# EAGLE design Display_PCB_Rev_1 (EAGLE 7.3.0)
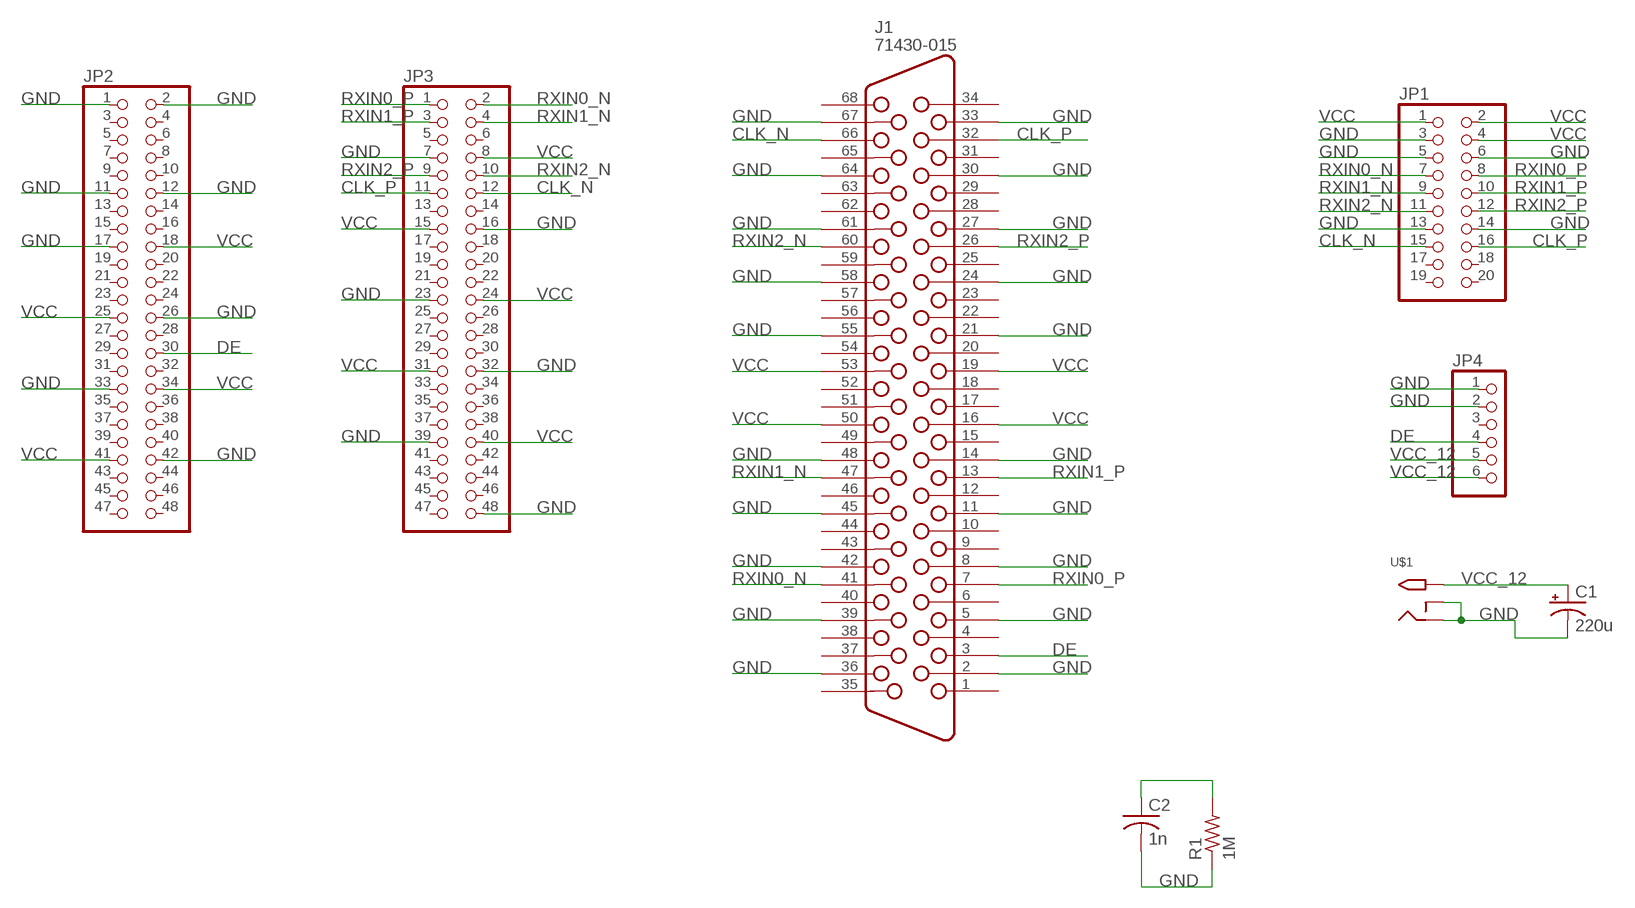
[diagram p0: schematic, sheet 1]

## Parts
C1  220u  CPOL-USE5-8.5  [E5-8,5]
C2  1n  C-USC0805  [C0805]
J1  71430-015  [71430-015]
JP1  PINHD-2X10M  [2X10M]
JP2  PINHD-2X24  [2X24]
JP3  PINHD-2X24  [2X24]
JP4  PINHD-1X6M  [1X06M]
R1  1M  R-US_R0805W  [R0805W]
U$1  2.1MMJACKTHM  [PJ-102A]

## Nets
CLK_N: J1.66 JP1.15 JP3.12
CLK_P: J1.32 JP1.16 JP3.11
DE: J1.3 JP2.30 JP4.4
GND: C1.- C2.2 J1.2 J1.5 J1.8 J1.11 J1.14 J1.21 J1.24 J1.27 J1.30 J1.33 J1.36 J1.39 J1.42 J1.45 J1.48 J1.55 J1.58 J1.61 J1.64 J1.67 JP1.3 JP1.5 JP1.6 JP1.13 JP1.14 JP2.1 JP2.2 JP2.11 JP2.12 JP2.17 JP2.26 JP2.33 JP2.42 JP3.7 JP3.16 JP3.23 JP3.32 JP3.39 JP3.48 JP4.1 JP4.2 R1.1 U$1.RING U$1.RING_SW
N$1: C2.1 R1.2
RXIN0_N: J1.41 JP1.7 JP3.2
RXIN0_P: J1.7 JP1.8 JP3.1
RXIN1_N: J1.47 JP1.9 JP3.4
RXIN1_P: J1.13 JP1.10 JP3.3
RXIN2_N: J1.60 JP1.11 JP3.10
RXIN2_P: J1.26 JP1.12 JP3.9
VCC: J1.16 J1.19 J1.50 J1.53 JP1.1 JP1.2 JP1.4 JP2.18 JP2.25 JP2.34 JP2.41 JP3.8 JP3.15 JP3.24 JP3.31 JP3.40
VCC_12: C1.+ JP4.5 JP4.6 U$1.TIP
Unconnected: J1.1 J1.4 J1.6 J1.9 J1.10 J1.12 J1.15 J1.17 J1.18 J1.20 J1.22 J1.23 J1.25 J1.28 J1.29 J1.31 J1.34 J1.35 J1.37 J1.38 J1.40 J1.43 J1.44 J1.46 J1.49 J1.51 J1.52 J1.54 J1.56 J1.57 J1.59 J1.62 J1.63 J1.65 J1.68 JP1.17 JP1.18 JP1.19 JP1.20 JP2.3 JP2.4 JP2.5 JP2.6 JP2.7 JP2.8 JP2.9 JP2.10 JP2.13 JP2.14 JP2.15 JP2.16 JP2.19 JP2.20 JP2.21 JP2.22 JP2.23 JP2.24 JP2.27 JP2.28 JP2.29 JP2.31 JP2.32 JP2.35 JP2.36 JP2.37 JP2.38 JP2.39 JP2.40 JP2.43 JP2.44 JP2.45 JP2.46 JP2.47 JP2.48 JP3.5 JP3.6 JP3.13 JP3.14 JP3.17 JP3.18 JP3.19 JP3.20 JP3.21 JP3.22 JP3.25 JP3.26 JP3.27 JP3.28 JP3.29 JP3.30 JP3.33 JP3.34 JP3.35 JP3.36 JP3.37 JP3.38 JP3.41 JP3.42 JP3.43 JP3.44 JP3.45 JP3.46 JP3.47 JP4.3

## Library data of the parts
C1 = resistor:CPOL-US: POLARIZED CAPACITOR, American symbol
C2 = resistor:C-US: CAPACITOR, American symbol
J1 = con-molex-vhdci:71430-015: VHDCI CONNECTOR
JP1 = pinhead:PINHD-2X10: PIN HEADER
JP2 JP3 = pinhead:PINHD-2X24: PIN HEADER
JP4 = pinhead:PINHD-1X6: PIN HEADER
R1 = resistor:R-US_: RESISTOR, American symbol
U$1 = adafruit:2.1MMJACK: 2.1mm x 5.5mm THM DC jack with internal switch. Digikey part #PJ-102A, 4UCON part #05537 2.1mm x 5.5mm SMT DC jack with internal switch. Digikey part #PJ-002A-SMT, 4UCON part #03267 By microbuilder.eu & adafruit.com

## Board
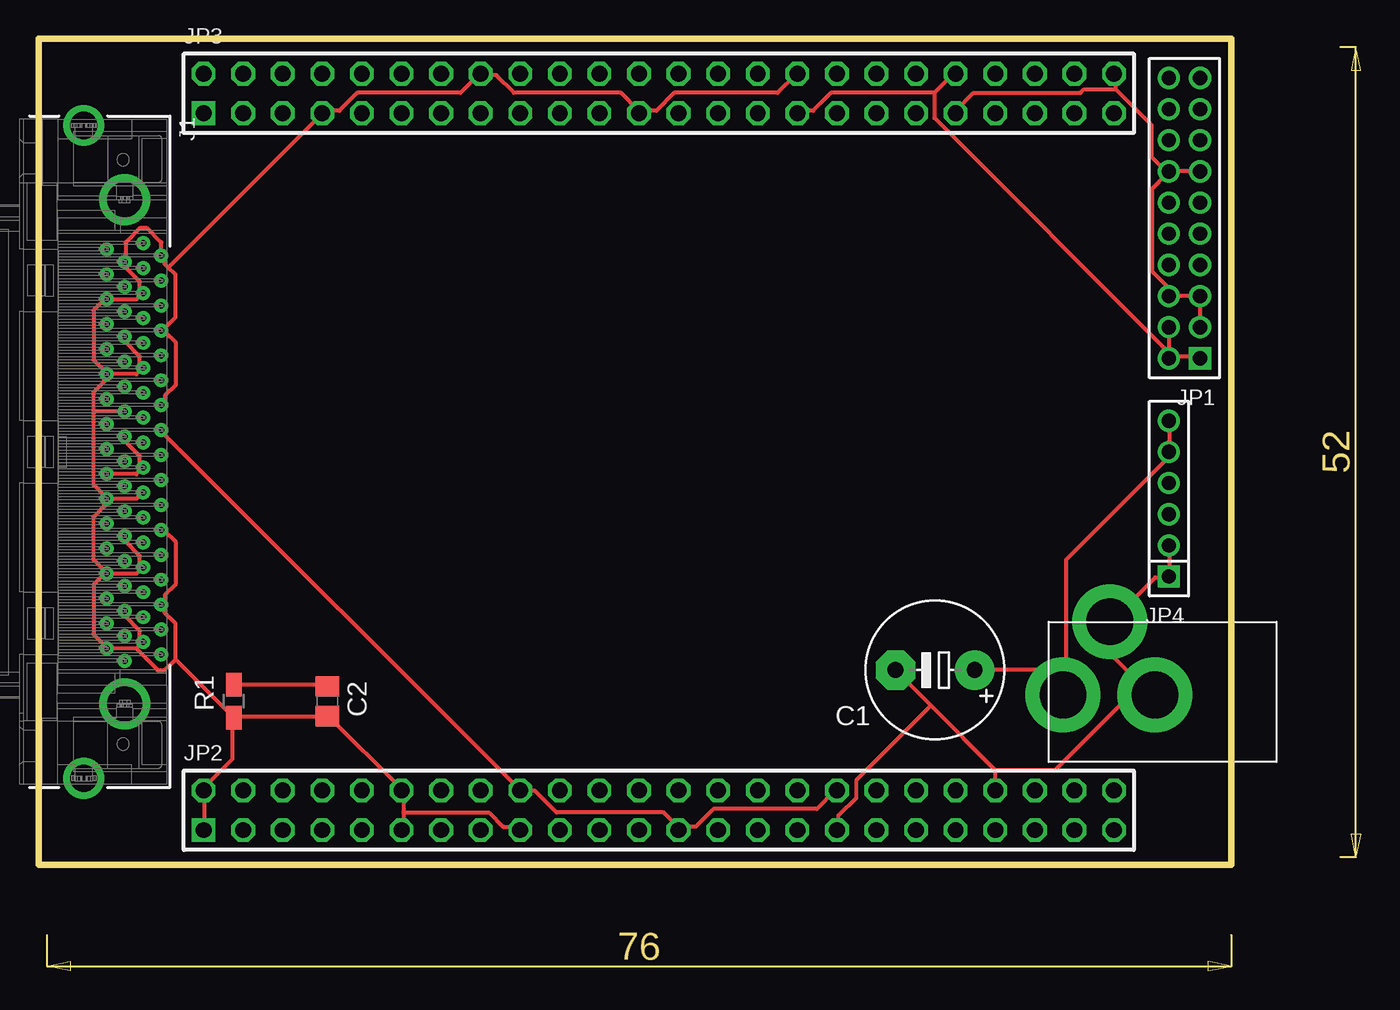
[diagram p1: board, top side]
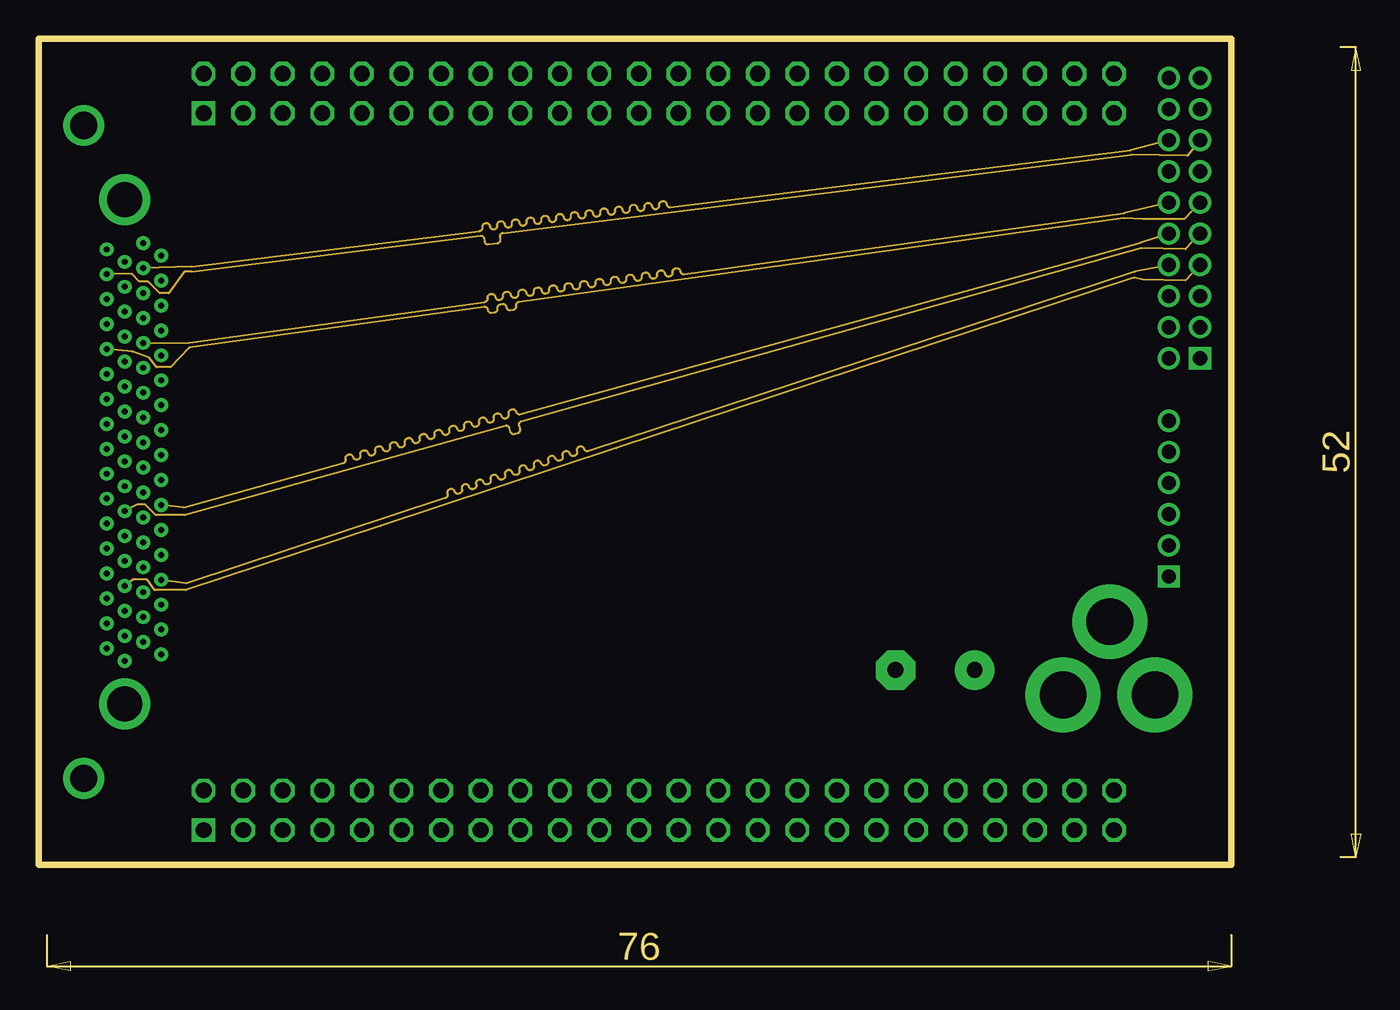
[diagram p2: board, inner layer Route2]
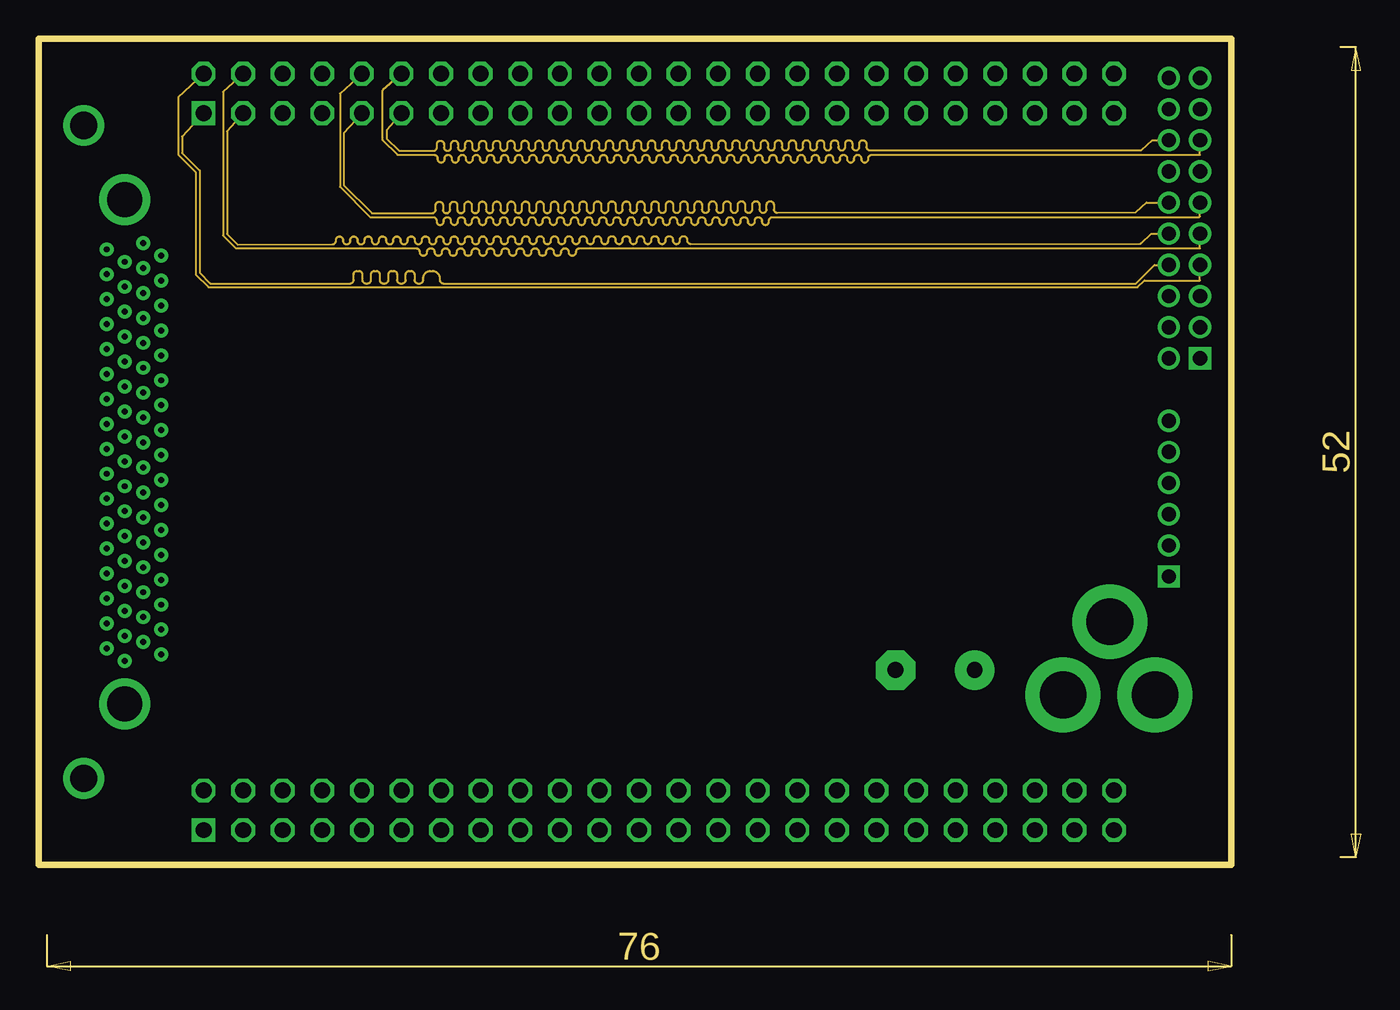
[diagram p3: board, inner layer Route3]
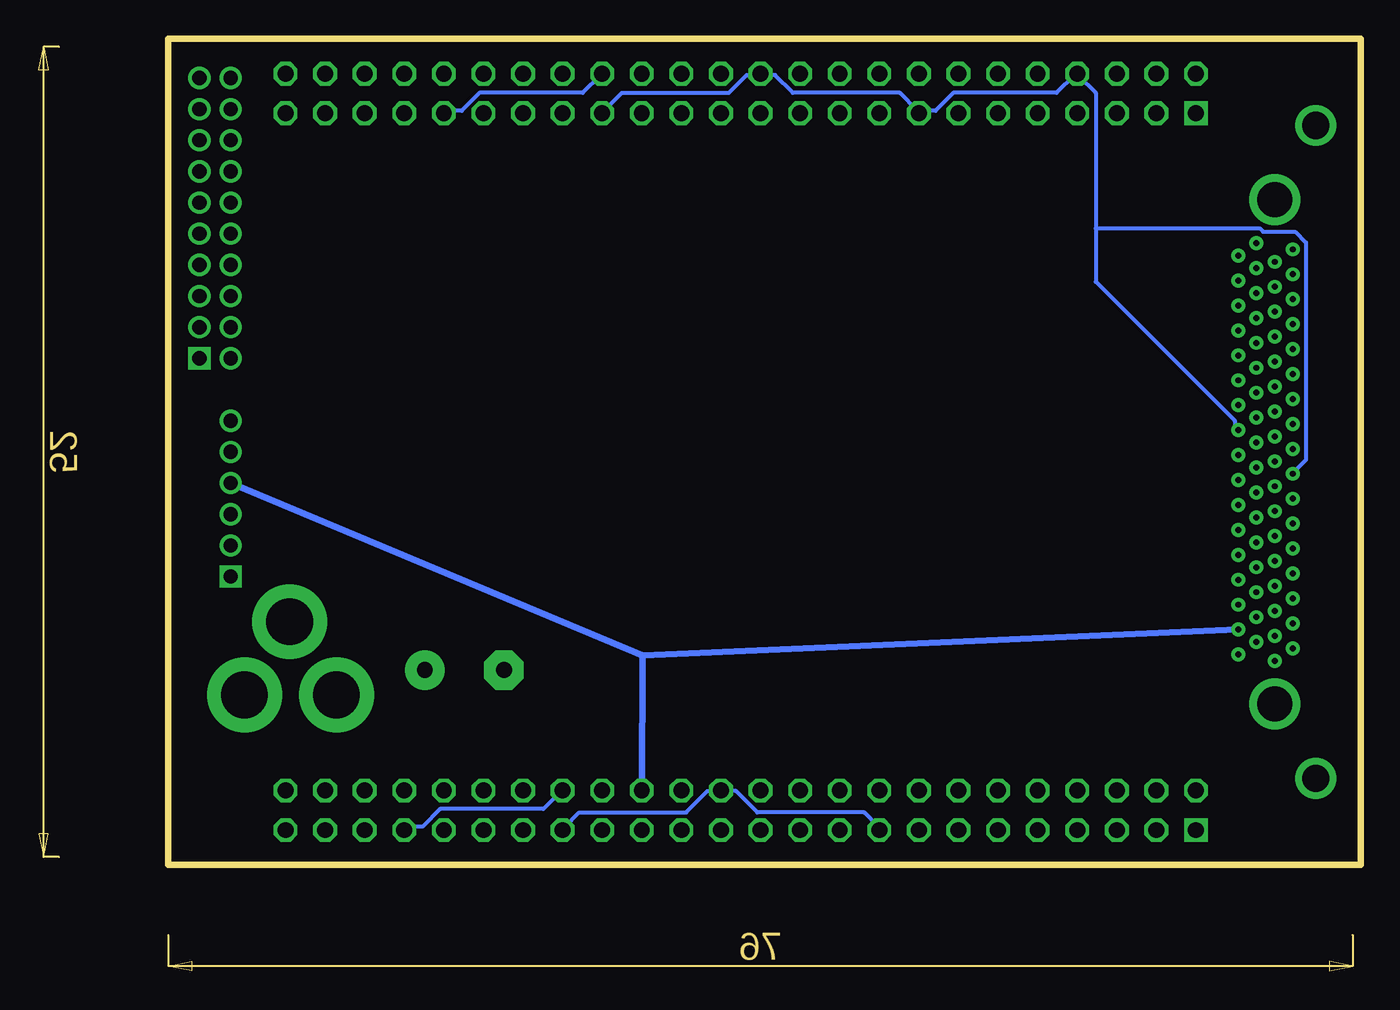
[diagram p4: board, bottom side, seen from below]

Size 76.5 x 53 mm. Coordinates in mm from the lower left corner, seen from the top.
Outline: 0,0 76.5,0 76.5,53 0,53 0,0
Copper layers (1*2+3*16): Top 0.035mm / dielectric 0.48mm / Route2 0.035mm / dielectric 0.49mm / Route3 0.035mm / dielectric 0.48mm / Bottom 0.035mm
Design rules "dirt_cheap_dirty_boards.v1 *": minimum track width 5mil, minimum drill 12mil, track to track 5mil, track to pad 5mil, pad to pad 5mil, via to via 5mil, smd to smd 0mil, copper to edge 10mil, drill to drill 10mil, minimum pad ring 10mil, minimum via ring 6mil, stop-mask expansion 2mil, vias tented up to drill 25mil, thermal gap 10mil

### Footprints (pad centres in the part's own frame; a part is rotated, then mirrored left to right if it is on the bottom)
E5-8,5 = drill 1.016 pad 2.54: + -2.54,0 | drill 1.016 pad 2.54 octagon: - 2.54,0
C0805 = smd 1.3 x 1.5: 1 -0.95,0; 2 0.95,0
71430-015 = drill 0.381: 1 13.005,2.35; 2 12.205,1.2; 3 11.405,2.35; 4 10.605,1.2; 5 9.805,2.35; 6 9.005,1.2; 7 8.205,2.35; 8 7.405,1.2; 9 6.605,2.35; 10 5.805,1.2; 11 5.005,2.35; 12 4.205,1.2; 13 3.405,2.35; 14 2.605,1.2; 15 1.805,2.35; 16 1.005,1.2; 17 0.205,2.35; 18 -0.595,1.2; 19 -1.395,2.35; 20 -2.195,1.2; 21 -2.995,2.35; 22 -3.795,1.2; 23 -4.595,2.35; 24 -5.395,1.2; 25 -6.195,2.35; 26 -6.995,1.2; 27 -7.795,2.35; 28 -8.595,1.2; 29 -9.395,2.35; 30 -10.195,1.2; 31 -10.995,2.35; 32 -11.795,1.2; 33 -12.595,2.35; 34 -13.395,1.2; 35 13.405,0; 36 12.605,-1.15; 37 11.805,0; 38 11.005,-1.15; 39 10.205,0; 40 9.405,-1.15; 41 8.605,0; 42 7.805,-1.15; 43 7.005,0; 44 6.205,-1.15; 45 5.405,0; 46 4.605,-1.15; 47 3.805,0; 48 3.005,-1.15; 49 2.205,0; 50 1.405,-1.15; 51 0.605,0; 52 -0.195,-1.15; 53 -0.995,0; 54 -1.795,-1.15; 55 -2.595,0; 56 -3.395,-1.15; 57 -4.195,0; 58 -4.995,-1.15; 59 -5.795,0; 60 -6.595,-1.15; 61 -7.395,0; 62 -8.195,-1.15; 63 -8.995,0; 64 -9.795,-1.15; 65 -10.595,0; 66 -11.395,-1.15; 67 -12.195,0; 68 -12.995,-1.15 | drill 2.25: M1 16.175,0; M2 -16.175,0 | drill 1.75: M3 -20.95,-2.63; M4 20.95,-2.63
2X10M = drill 0.914 square: 1 -9,-1 | drill 0.914: 2 -9,1; 3 -7,-1; 4 -7,1; 5 -5,-1; 6 -5,1; 7 -3,-1; 8 -3,1; 9 -1,-1; 10 -1,1; 11 1,-1; 12 1,1; 13 3,-1; 14 3,1; 15 5,-1; 16 5,1; 17 7,-1; 18 7,1; 19 9,-1; 20 9,1
2X24 = drill 1.016 square: 1 -27.94,-1.27 | drill 1.016 octagon: 2 -27.94,1.27; 3 -25.4,-1.27; 4 -25.4,1.27; 5 -22.86,-1.27; 6 -22.86,1.27; 7 -20.32,-1.27; 8 -20.32,1.27; 9 -17.78,-1.27; 10 -17.78,1.27; 11 -15.24,-1.27; 12 -15.24,1.27; 13 -12.7,-1.27; 14 -12.7,1.27; 15 -10.16,-1.27; 16 -10.16,1.27; 17 -7.62,-1.27; 18 -7.62,1.27; 19 -5.08,-1.27; 20 -5.08,1.27; 21 -2.54,-1.27; 22 -2.54,1.27; 23 0,-1.27; 24 0,1.27; 25 2.54,-1.27; 26 2.54,1.27; 27 5.08,-1.27; 28 5.08,1.27; 29 7.62,-1.27; 30 7.62,1.27; 31 10.16,-1.27; 32 10.16,1.27; 33 12.7,-1.27; 34 12.7,1.27; 35 15.24,-1.27; 36 15.24,1.27; 37 17.78,-1.27; 38 17.78,1.27; 39 20.32,-1.27; 40 20.32,1.27; 41 22.86,-1.27; 42 22.86,1.27; 43 25.4,-1.27; 44 25.4,1.27; 45 27.94,-1.27; 46 27.94,1.27; 47 30.48,-1.27; 48 30.48,1.27
1X06M = drill 0.914 square: 1 -5,0 | drill 0.914: 2 -3,0; 3 -1,0; 4 1,0; 5 3,0; 6 5,0
R0805W = smd 1.5 x 1: 1 -1.052,0; 2 1.052,0
PJ-102A = drill 3 pad 4.8: RING 0.1,-3.39; RING_SW -4.6,-6.29; TIP 0.1,-9.29

### Placement (x,y rotation side)
C1  57.5,12.5 180 top
C2  18.5,10.5 270 top
J1  5.5,26.5 270 top
JP1  73.5,41.5 90 top
JP2  38.5,3.5 0 top
JP3  38.5,49.5 0 top
JP4  72.5,23.5 90 top
R1  12.5,10.5 90 top
U$1  75,11 270 top

### Tracks (layer width: path | path; a pad name or v marks a point on that pad's centre or on a via)
CLK_N
  Route2 0.127: J1.66 5.94,37.94 6.44,37.44 7,37.44 7.75,36.69 8.31,36.69 9.31,38.06 9.8,38.07 28.32,40.37 arc-90 28.57,40.18 28.59,40.01 arc90 28.84,39.82 29.42,39.89 arc90 29.61,40.14 29.59,40.31 arc-90 29.78,40.55 70.08,45.56 73.69,45.5 JP1.15
  Route3 0.127: JP3.12 22.06,49.7 22.06,46.51 23.01,45.56 25.35,45.56 arc-90 25.58,45.34 25.58,45.29 arc90 25.8,45.07 25.81,45.07 arc90 26.03,45.29 26.03,45.34 arc-90 26.25,45.56 26.26,45.56 arc-90 26.48,45.34 26.48,45.29 arc90 26.7,45.07 26.71,45.07 arc90 26.94,45.29 26.94,45.34 arc-90 27.16,45.56 27.17,45.56 arc-90 27.39,45.34 27.39,45.29 arc90 27.61,45.07 27.62,45.07 arc90 27.84,45.29 27.84,45.34 arc-90 28.06,45.56 28.07,45.56 arc-90 28.3,45.34 28.3,45.29 arc90 28.52,45.07 28.53,45.07 arc90 28.75,45.29 28.75,45.34 arc-90 28.97,45.56 28.98,45.56 arc-90 29.2,45.34 29.2,45.29 arc90 29.42,45.07 29.43,45.07 arc90 29.65,45.29 29.65,45.34 arc-90 29.88,45.56 29.88,45.56 arc-90 30.11,45.34 30.11,45.29 arc90 30.33,45.07 30.34,45.07 arc90 30.56,45.29 30.56,45.34 arc-90 30.78,45.56 30.79,45.56 arc-90 31.01,45.34 31.01,45.29 arc90 31.24,45.07 31.24,45.07 arc90 31.47,45.29 31.47,45.34 arc-90 31.69,45.56 31.7,45.56 arc-90 31.92,45.34 31.92,45.29 arc90 32.14,45.07 32.15,45.07 arc90 32.37,45.29 32.37,45.34 arc-90 32.59,45.56 32.6,45.56 arc-90 32.83,45.34 32.83,45.29 arc90 33.05,45.07 33.06,45.07 arc90 33.28,45.29 33.28,45.34 arc-90 33.5,45.56 33.51,45.56 arc-90 33.73,45.34 33.73,45.29 arc90 33.95,45.07 33.96,45.07 arc90 34.19,45.29 34.19,45.34 arc-90 34.41,45.56 34.42,45.56 arc-90 34.64,45.34 34.64,45.29 arc90 34.86,45.07 34.87,45.07 arc90 35.09,45.29 35.09,45.34 arc-90 35.31,45.56 35.32,45.56 arc-90 35.55,45.34 35.55,45.29 arc90 35.77,45.07 35.77,45.07 arc90 36,45.29 36,45.34 arc-90 36.22,45.56 36.23,45.56 arc-90 36.45,45.34 36.45,45.29 arc90 36.67,45.07 36.68,45.07 arc90 36.9,45.29 36.9,45.34 arc-90 37.13,45.56 37.13,45.56 arc-90 37.36,45.34 37.36,45.29 arc90 37.58,45.07 37.59,45.07 arc90 37.81,45.29 37.81,45.34 arc-90 38.03,45.56 38.04,45.56 arc-90 38.26,45.34 38.26,45.29 arc90 38.48,45.07 38.49,45.07 arc90 38.72,45.29 38.72,45.34 arc-90 38.94,45.56 38.95,45.56 arc-90 39.17,45.34 39.17,45.29 arc90 39.39,45.07 39.4,45.07 arc90 39.62,45.29 39.62,45.34 arc-90 39.84,45.56 39.85,45.56 arc-90 40.08,45.34 40.08,45.29 arc90 40.3,45.07 40.31,45.07 arc90 40.53,45.29 40.53,45.34 arc-90 40.75,45.56 40.76,45.56 arc-90 40.98,45.34 40.98,45.29 arc90 41.2,45.07 41.21,45.07 arc90 41.44,45.29 41.44,45.34 arc-90 41.66,45.56 41.67,45.56 arc-90 41.89,45.34 41.89,45.29 arc90 42.11,45.07 42.12,45.07 arc90 42.34,45.29 42.34,45.34 arc-90 42.56,45.56 42.57,45.56 arc-90 42.79,45.34 42.79,45.29 arc90 43.02,45.07 43.02,45.07 arc90 43.25,45.29 43.25,45.34 arc-90 43.47,45.56 43.48,45.56 arc-90 43.7,45.34 43.7,45.29 arc90 43.92,45.07 43.93,45.07 arc90 44.15,45.29 44.15,45.34 arc-90 44.38,45.56 44.38,45.56 arc-90 44.61,45.34 44.61,45.29 arc90 44.83,45.07 44.84,45.07 arc90 45.06,45.29 45.06,45.34 arc-90 45.28,45.56 45.29,45.56 arc-90 45.51,45.34 45.51,45.29 arc90 45.73,45.07 45.74,45.07 arc90 45.97,45.29 45.97,45.34 arc-90 46.19,45.56 46.2,45.56 arc-90 46.42,45.34 46.42,45.29 arc90 46.64,45.07 46.65,45.07 arc90 46.87,45.29 46.87,45.34 arc-90 47.09,45.56 47.1,45.56 arc-90 47.33,45.34 47.33,45.29 arc90 47.55,45.07 47.56,45.07 arc90 47.78,45.29 47.78,45.34 arc-90 48,45.56 48.01,45.56 arc-90 48.23,45.34 48.23,45.29 arc90 48.45,45.07 48.46,45.07 arc90 48.68,45.29 48.68,45.34 arc-90 48.91,45.56 48.91,45.56 arc-90 49.14,45.34 49.14,45.29 arc90 49.36,45.07 49.37,45.07 arc90 49.59,45.29 49.59,45.34 arc-90 49.81,45.56 49.82,45.56 arc-90 50.04,45.34 50.04,45.29 arc90 50.27,45.07 50.27,45.07 arc90 50.5,45.29 50.5,45.34 arc-90 50.72,45.56 50.73,45.56 arc-90 50.95,45.34 50.95,45.29 arc90 51.17,45.07 51.18,45.07 arc90 51.4,45.29 51.4,45.34 arc-90 51.62,45.56 51.63,45.56 arc-90 51.86,45.34 51.86,45.29 arc90 52.08,45.07 52.09,45.07 arc90 52.31,45.29 52.31,45.34 arc-90 52.53,45.56 52.54,45.56 arc-90 52.76,45.34 52.76,45.29 arc90 52.98,45.07 52.99,45.07 arc90 53.22,45.29 53.22,45.34 arc-90 53.44,45.56 70.75,45.56 74.5,45.56 JP1.15
CLK_P
  Route2 0.127: J1.32 9.81,38.38 28.27,40.67 arc90 28.46,40.92 28.46,40.93 arc-90 28.66,41.18 28.69,41.18 arc-90 28.93,40.99 28.94,40.98 arc90 29.18,40.79 29.22,40.79 arc90 29.41,41.04 29.41,41.05 arc-90 29.6,41.3 29.63,41.3 arc-90 29.88,41.11 29.88,41.1 arc90 30.13,40.91 30.16,40.91 arc90 30.35,41.16 30.35,41.17 arc-90 30.55,41.41 30.58,41.42 arc-90 30.82,41.22 30.83,41.22 arc90 31.07,41.02 31.1,41.03 arc90 31.3,41.28 31.3,41.28 arc-90 31.49,41.53 31.52,41.54 arc-90 31.77,41.34 31.77,41.33 arc90 32.02,41.14 32.05,41.14 arc90 32.24,41.39 32.24,41.4 arc-90 32.43,41.65 32.47,41.65 arc-90 32.71,41.46 32.72,41.45 arc90 32.96,41.26 32.99,41.26 arc90 33.19,41.51 33.19,41.52 arc-90 33.38,41.77 33.41,41.77 arc-90 33.66,41.58 33.66,41.57 arc90 33.91,41.38 33.94,41.38 arc90 34.13,41.63 34.13,41.64 arc-90 34.32,41.89 34.35,41.89 arc-90 34.6,41.69 34.6,41.69 arc90 34.85,41.49 34.88,41.5 arc90 35.08,41.75 35.08,41.75 arc-90 35.27,42 35.3,42.01 arc-90 35.55,41.81 35.55,41.81 arc90 35.8,41.61 35.83,41.62 arc90 36.02,41.86 36.02,41.87 arc-90 36.21,42.12 36.24,42.12 arc-90 36.49,41.93 36.49,41.92 arc90 36.74,41.73 36.77,41.73 arc90 36.97,41.98 36.97,41.99 arc-90 37.16,42.24 37.19,42.24 arc-90 37.44,42.05 37.44,42.04 arc90 37.69,41.85 37.72,41.85 arc90 37.91,42.1 37.91,42.11 arc-90 38.1,42.36 38.13,42.36 arc-90 38.38,42.17 38.38,42.16 arc90 38.63,41.97 38.66,41.97 arc90 38.86,42.22 38.85,42.22 arc-90 39.05,42.47 39.08,42.48 arc-90 39.33,42.28 39.33,42.28 arc90 39.58,42.08 39.61,42.09 arc90 39.8,42.33 39.8,42.34 arc-90 39.99,42.59 40.02,42.59 arc-90 40.27,42.4 40.27,42.39 arc90 40.52,42.2 70.05,45.88 JP1.16
  Route3 0.127: JP3.11 22.31,47.16 22.31,46.61 23.12,45.81 25.31,45.82 arc90 25.54,46.04 25.54,46.24 arc-90 25.76,46.47 25.77,46.47 arc-90 25.99,46.24 25.99,46.04 arc90 26.21,45.82 26.22,45.82 arc90 26.44,46.04 26.44,46.25 arc-90 26.66,46.47 26.67,46.47 arc-90 26.89,46.25 26.89,46.04 arc90 27.11,45.82 27.12,45.82 arc90 27.34,46.04 27.34,46.25 arc-90 27.56,46.47 27.57,46.47 arc-90 27.8,46.25 27.8,46.04 arc90 28.02,45.82 28.02,45.82 arc90 28.25,46.04 28.25,46.25 arc-90 28.47,46.47 28.48,46.47 arc-90 28.7,46.25 28.7,46.04 arc90 28.92,45.82 28.93,45.82 arc90 29.15,46.05 29.15,46.25 arc-90 29.37,46.47 29.38,46.47 arc-90 29.6,46.25 29.6,46.05 arc90 29.82,45.82 29.83,45.82 arc90 30.05,46.05 30.05,46.25 arc-90 30.27,46.47 30.28,46.47 arc-90 30.51,46.25 30.51,46.05 arc90 30.73,45.82 30.73,45.82 arc90 30.96,46.05 30.96,46.25 arc-90 31.18,46.47 31.19,46.47 arc-90 31.41,46.25 31.41,46.05 arc90 31.63,45.83 31.64,45.83 arc90 31.86,46.05 31.86,46.25 arc-90 32.08,46.47 32.09,46.47 arc-90 32.31,46.25 32.31,46.05 arc90 32.53,45.83 32.54,45.83 arc90 32.76,46.05 32.76,46.25 arc-90 32.99,46.48 32.99,46.48 arc-90 33.22,46.25 33.22,46.05 arc90 33.44,45.83 33.45,45.83 arc90 33.67,46.05 33.67,46.25 arc-90 33.89,46.48 33.9,46.48 arc-90 34.12,46.25 34.12,46.05 arc90 34.34,45.83 34.35,45.83 arc90 34.57,46.05 34.57,46.26 arc-90 34.79,46.48 34.8,46.48 arc-90 35.02,46.26 35.02,46.05 arc90 35.24,45.83 35.25,45.83 arc90 35.47,46.05 35.47,46.26 arc-90 35.7,46.48 35.7,46.48 arc-90 35.93,46.26 35.93,46.05 arc90 36.15,45.83 36.16,45.83 arc90 36.38,46.05 36.38,46.26 arc-90 36.6,46.48 36.61,46.48 arc-90 36.83,46.26 36.83,46.06 arc90 37.05,45.83 37.06,45.83 arc90 37.28,46.06 37.28,46.26 arc-90 37.5,46.48 37.51,46.48 arc-90 37.73,46.26 37.73,46.06 arc90 37.95,45.83 37.96,45.83 arc90 38.18,46.06 38.18,46.26 arc-90 38.41,46.48 38.41,46.48 arc-90 38.64,46.26 38.64,46.06 arc90 38.86,45.83 38.87,45.83 arc90 39.09,46.06 39.09,46.26 arc-90 39.31,46.48 39.32,46.48 arc-90 39.54,46.26 39.54,46.06 arc90 39.76,45.84 39.77,45.84 arc90 39.99,46.06 39.99,46.26 arc-90 40.21,46.48 40.22,46.48 arc-90 40.44,46.26 40.44,46.06 arc90 40.67,45.84 40.67,45.84 arc90 40.9,46.06 40.89,46.26 arc-90 41.12,46.49 41.12,46.49 arc-90 41.35,46.27 41.35,46.06 arc90 41.57,45.84 41.58,45.84 arc90 41.8,46.06 41.8,46.27 arc-90 42.02,46.49 42.03,46.49 arc-90 42.25,46.27 42.25,46.06 arc90 42.47,45.84 42.48,45.84 arc90 42.7,46.06 42.7,46.27 arc-90 42.92,46.49 42.93,46.49 arc-90 43.15,46.27 43.15,46.06 arc90 43.38,45.84 43.38,45.84 arc90 43.6,46.06 43.6,46.27 arc-90 43.83,46.49 43.83,46.49 arc-90 44.06,46.27 44.06,46.06 arc90 44.28,45.84 44.29,45.84 arc90 44.51,46.06 44.51,46.27 arc-90 44.73,46.49 44.74,46.49 arc-90 44.96,46.27 44.96,46.06 arc90 45.18,45.84 45.19,45.84 arc90 45.41,46.07 45.41,46.27 arc-90 45.63,46.49 45.64,46.49 arc-90 45.86,46.27 45.86,46.07 arc90 46.09,45.84 46.09,45.84 arc90 46.31,46.07 46.31,46.27 arc-90 46.54,46.49 46.54,46.49 arc-90 46.77,46.27 46.77,46.07 arc90 46.99,45.85 47,45.85 arc90 47.22,46.07 47.22,46.27 arc-90 47.44,46.5 47.45,46.5 arc-90 47.67,46.27 47.67,46.07 arc90 47.89,45.85 47.9,45.85 arc90 48.12,46.07 48.12,46.27 arc-90 48.34,46.5 48.35,46.5 arc-90 48.57,46.27 48.57,46.07 arc90 48.8,45.85 48.8,45.85 arc90 49.02,46.07 49.02,46.28 arc-90 49.25,46.5 49.25,46.5 arc-90 49.48,46.28 49.48,46.07 arc90 49.7,45.85 49.71,45.85 arc90 49.93,46.07 49.93,46.28 arc-90 50.15,46.5 50.16,46.5 arc-90 50.38,46.28 50.38,46.07 arc90 50.6,45.85 50.61,45.85 arc90 50.83,46.07 50.83,46.28 arc-90 51.05,46.5 51.06,46.5 arc-90 51.28,46.28 51.28,46.07 arc90 51.51,45.85 51.51,45.85 arc90 51.74,46.07 51.73,46.28 arc-90 51.96,46.5 51.97,46.5 arc-90 52.19,46.28 52.19,46.08 arc90 52.41,45.85 52.42,45.85 arc90 52.64,46.08 52.64,46.28 arc-90 52.86,46.5 52.87,46.5 arc-90 53.09,46.28 53.09,46.08 arc90 53.31,45.85 70.75,45.88 71.44,46.5 JP1.16
DE
  Bottom 0.406: JP4.4 46.06,13.44 | 46.06,13.44 JP2.30 | J1.3 46.06,13.44
GND
  Top 0.254: JP1.14 72.54,44.51 74.37,44.51 JP1.13 | 69.11,49.77 69.11,50.68 JP3.48 | 69.11,49.77 71.4,47.48 71.4,45.42 72.31,44.51 JP1.14 | JP1.14 72.31,44.28 71.4,43.37 71.4,38.11 72.31,37.19 72.31,36.51 JP1.6 72.54,36.51 74.37,36.51 JP1.5 JP1.3 | JP3.32 48.54,50.68 47.39,49.54 40.76,49.54 39.62,48.39 38.71,48.39 JP3.23 38.48,48.39 37.34,49.54 30.48,49.54 29.33,50.68 28.42,50.68 JP3.16 28.19,50.68 27.05,49.54 20.42,49.54 19.27,48.39 18.36,48.39 JP3.7 18.13,48.17 8.3,38.34 | 69.11,49.77 67.05,49.77 66.82,49.54 59.97,49.54 58.82,48.39 JP3.39 | JP4.2 72.54,20.28 72.54,18.68 JP4.1 72.31,18.45 71.62,18.45 68.88,15.7 U$1.RING_SW 68.88,15.48 68.88,13.42 70.71,11.59 | 70.71,11.59 71.4,10.91 U$1.RING 70.71,11.59 | 61.34,6.1 61.34,4.96 JP2.42 | 57.22,10.22 55.17,12.28 C1.- | 57.22,10.22 61.34,6.1 | 57.22,10.22 52.42,5.42 52.42,4.27 51.28,3.13 51.28,2.45 JP2.33 | 70.71,11.59 65.22,6.1 61.34,6.1 | J1.58 4.42,31.48 6.25,31.48 6.47,31.71 J1.24 6.47,31.94 6.47,32.62 5.56,33.54 5.56,33.77 J1.61 | J1.58 4.19,31.71 3.5,32.39 3.5,35.59 4.19,36.28 J1.64 4.42,36.28 6.25,36.28 6.47,36.51 J1.30 6.47,36.74 6.47,37.42 5.56,38.34 5.56,38.56 J1.67 5.56,38.79 5.56,39.94 6.47,40.85 6.93,40.85 7.84,39.94 7.84,39.25 J1.33 8.07,39.02 8.07,38.56 8.3,38.34 | J1.21 8.07,29.65 8.07,30.11 8.76,30.79 8.76,33.54 8.07,34.22 J1.27 8.07,34.45 8.76,35.14 8.76,37.88 8.3,38.34 | J1.11 8.07,21.42 8.76,20.73 8.76,17.99 8.07,17.31 8.07,16.85 J1.5 8.07,16.62 8.07,16.16 8.76,15.48 8.76,13.19 | 6.25,13.88 4.42,13.88 J1.36 4.19,14.1 3.5,14.79 3.5,17.99 4.19,18.68 J1.42 | 6.25,13.88 6.47,14.1 J1.2 6.47,14.33 6.47,15.02 5.56,15.93 5.56,16.16 J1.39
  Top 0.254: J1.48 4.42,23.48 6.25,23.48 6.47,23.71 J1.14 | J1.42 4.42,18.68 6.25,18.68 6.47,18.91 J1.8 6.47,19.13 6.47,19.82 5.56,20.73 5.56,20.96 J1.45 | J1.48 4.19,23.48 4.19,23.02 3.5,22.34 3.5,19.59 4.19,18.91 J1.42 | 8.76,13.19 8.07,12.51 7.62,12.51 6.25,13.88 | 3.5,29 3.5,24.39 4.19,23.71 J1.48 | 3.5,29 3.5,30.34 4.19,31.02 4.19,31.48 J1.58 | 23.39,3.36 23.39,4.73 JP2.12 23.16,4.96 18.59,9.53 C2.2 18.36,9.53 12.65,9.53 R1.1 | 23.39,3.36 23.39,2.45 JP2.11 | 23.39,3.36 28.88,3.36 29.79,2.45 30.7,2.45 JP2.17 | R1.1 12.42,9.3 12.42,6.79 10.59,4.96 JP2.2 10.59,4.73 10.59,2.45 JP2.1 | 8.76,13.19 12.42,9.53 R1.1 | J1.55 3.6,29.09 3.5,29
  Bottom 0.254: JP3.39 58.59,48.39 57.68,48.39 56.54,49.54 49.91,49.54 48.77,50.68 JP3.32 | JP2.33 51.05,2.45 50.14,3.36 43.28,3.36 41.91,4.73 41.22,4.73 JP2.26 40.99,4.73 40.08,4.73 38.71,3.36 31.85,3.36 30.93,2.45 JP2.17
N$1
  Top 0.254: C2.1 18.36,11.59 12.65,11.59 R1.2
RXIN0_N
  Route2 0.127: JP1.7 73.56,37.5 70.81,37.56 70.26,37.68 37.04,26.73 21.9,21.74 9.41,17.63 7.44,17.62 6.94,18.31 6.06,18.31 J1.41
  Route3 0.127: JP3.2 8.94,49.27 8.94,45.57 10.06,44.45 10.06,37.89 10.89,37.06 70.49,37.06 70.93,37.5 74.5,37.5 JP1.7
RXIN0_P
  Route2 0.127: JP1.8 70.31,38.06 35.26,26.55 arc-90 34.98,26.69 34.98,26.7 arc90 34.7,26.84 34.66,26.83 arc90 34.52,26.55 34.52,26.54 arc-90 34.38,26.26 34.34,26.24 arc-90 34.06,26.39 34.06,26.39 arc90 33.78,26.54 33.74,26.52 arc90 33.59,26.24 33.6,26.23 arc-90 33.46,25.95 33.42,25.94 arc-90 33.14,26.08 33.13,26.09 arc90 32.85,26.23 32.81,26.22 arc90 32.67,25.94 32.67,25.93 arc-90 32.53,25.65 32.49,25.64 arc-90 32.21,25.78 32.21,25.79 arc90 31.93,25.93 31.89,25.92 arc90 31.75,25.64 31.75,25.63 arc-90 31.61,25.35 31.57,25.33 arc-90 31.29,25.48 31.29,25.48 arc90 31.01,25.63 30.97,25.61 arc90 30.83,25.33 30.83,25.32 arc-90 30.69,25.04 30.65,25.03 arc-90 30.37,25.17 30.36,25.18 arc90 30.08,25.32 30.05,25.31 arc90 29.9,25.03 29.91,25.02 arc-90 29.76,24.74 29.73,24.73 arc-90 29.44,24.87 29.44,24.88 arc90 29.16,25.02 29.12,25.01 arc90 28.98,24.73 28.98,24.72 arc-90 28.84,24.44 28.8,24.42 arc-90 28.52,24.57 28.52,24.57 arc90 28.24,24.72 28.2,24.7 arc90 28.06,24.42 28.06,24.41 arc-90 27.92,24.13 27.88,24.12 arc-90 27.6,24.26 27.59,24.27 arc90 27.31,24.41 27.27,24.4 arc90 27.13,24.12 27.14,24.11 arc-90 26.99,23.83 26.95,23.82 arc-90 26.67,23.96 26.67,23.97 arc90 26.39,24.11 26.35,24.1 arc90 26.21,23.82 26.21,23.81 arc-90 26.07,23.53 9.44,18.06 J1.7
  Route3 0.127: JP3.1 9.19,46.73 9.19,45.68 10.31,44.55 10.31,37.99 10.99,37.31 19.97,37.31 arc90 20.19,37.54 20.19,37.89 arc-90 20.41,38.11 20.53,38.11 arc-90 20.75,37.89 20.75,37.54 arc90 20.97,37.31 21.08,37.31 arc90 21.31,37.54 21.31,37.89 arc-90 21.53,38.11 21.64,38.11 arc-90 21.86,37.89 21.86,37.54 arc90 22.09,37.31 22.2,37.31 arc90 22.42,37.54 22.42,37.89 arc-90 22.64,38.11 22.76,38.11 arc-90 22.98,37.89 22.98,37.54 arc90 23.2,37.31 23.31,37.31 arc90 23.53,37.54 23.53,37.89 arc-90 23.76,38.11 23.87,38.11 arc-90 24.09,37.89 24.09,37.54 arc90 24.31,37.31 24.43,37.31 arc90 24.65,37.54 24.65,37.64 arc-90 25.13,38.11 25.24,38.11 arc-90 25.72,37.64 25.72,37.54 arc90 25.94,37.31 70.39,37.31 71.57,38.5 JP1.8
RXIN1_N
  Route2 0.127: JP1.9 73.56,39.5 70.75,39.56 30.95,28.46 arc90 30.8,28.18 30.86,27.95 arc-90 30.71,27.68 30.53,27.63 arc-90 30.26,27.79 30.19,28.02 arc90 29.92,28.17 9.38,22.44 7.5,22.44 6.81,23.12 6.31,23.12 J1.47
  Route3 0.127: JP3.4 11.81,49.61 11.81,40.39 12.64,39.56 24.2,39.56 arc-90 24.43,39.34 24.43,39.32 arc90 24.65,39.1 24.68,39.1 arc90 24.91,39.32 24.91,39.34 arc-90 25.13,39.56 25.16,39.56 arc-90 25.38,39.34 25.38,39.32 arc90 25.6,39.1 25.64,39.1 arc90 25.86,39.32 25.86,39.34 arc-90 26.08,39.56 26.12,39.56 arc-90 26.34,39.34 26.34,39.32 arc90 26.56,39.1 26.59,39.1 arc90 26.82,39.32 26.82,39.34 arc-90 27.04,39.56 27.07,39.56 arc-90 27.3,39.34 27.3,39.32 arc90 27.52,39.1 27.55,39.1 arc90 27.77,39.32 27.77,39.34 arc-90 27.99,39.56 28.03,39.56 arc-90 28.25,39.34 28.25,39.32 arc90 28.47,39.1 28.51,39.1 arc90 28.73,39.32 28.73,39.34 arc-90 28.95,39.56 28.98,39.56 arc-90 29.21,39.34 29.21,39.32 arc90 29.43,39.1 29.46,39.1 arc90 29.69,39.32 29.69,39.34 arc-90 29.91,39.56 29.94,39.56 arc-90 30.16,39.34 30.16,39.32 arc90 30.38,39.1 30.42,39.1 arc90 30.64,39.32 30.64,39.34 arc-90 30.86,39.56 30.9,39.56 arc-90 31.12,39.34 31.12,39.32 arc90 31.34,39.1 31.38,39.1 arc90 31.6,39.32 31.6,39.34 arc-90 31.82,39.56 31.85,39.56 arc-90 32.08,39.34 32.08,39.32 arc90 32.3,39.1 32.33,39.1 arc90 32.55,39.32 32.55,39.34 arc-90 32.77,39.56 32.81,39.56 arc-90 33.03,39.34 33.03,39.32 arc90 33.25,39.1 33.29,39.1 arc90 33.51,39.32 33.51,39.34 arc-90 33.73,39.56 33.77,39.56 arc-90 33.99,39.34 33.99,39.32 arc90 34.21,39.1 34.24,39.1 arc90 34.47,39.32 34.47,39.34 arc-90 34.69,39.56 70.69,39.56 74.5,39.56 JP1.9
RXIN1_P
  Route2 0.127: J1.13 9.28,22.94 19.52,25.77 arc90 19.68,26.05 | JP1.10 70.69,39.94 30.89,28.92 arc-90 30.62,29.07 30.62,29.08 arc90 30.35,29.23 30.3,29.22 arc90 30.14,28.94 | 19.68,26.05 | 19.68,26.05 arc-90 19.83,26.32 19.88,26.33 arc-90 20.15,26.18 20.15,26.18 arc90 20.43,26.02 20.47,26.03 arc90 20.63,26.31 20.63,26.31 arc-90 20.78,26.58 20.83,26.59 arc-90 21.1,26.44 | 21.1,26.44 | 21.1,26.44 arc90 21.38,26.28 21.43,26.3 arc90 21.58,26.57 | 21.58,26.57 | 21.58,26.57 arc-90 21.73,26.84 21.78,26.86 arc-90 22.06,26.7 22.06,26.7 arc90 22.33,26.55 22.38,26.56 arc90 22.53,26.84 | 22.53,26.84 | 22.53,26.84 arc-90 22.69,27.11 22.73,27.12 arc-90 23.01,26.97 | 23.01,26.97 | 23.01,26.97 arc90 23.28,26.81 23.33,26.83 arc90 23.48,27.1 23.48,27.1 arc-90 23.64,27.37 23.69,27.38 arc-90 23.96,27.23 23.96,27.23 arc90 24.23,27.08 24.28,27.09 arc90 24.44,27.36 | 24.44,27.36 | 24.44,27.36 arc-90 24.59,27.64 24.64,27.65 arc-90 24.91,27.49 | 24.91,27.49 | 24.91,27.49 arc90 25.18,27.34 25.23,27.35 arc90 25.39,27.62 25.39,27.63 arc-90 25.54,27.9 25.59,27.91 arc-90 25.86,27.76 25.86,27.76 arc90 26.14,27.6 26.18,27.62 arc90 26.34,27.89 | 26.34,27.89 | 26.34,27.89 arc-90 26.49,28.16 26.54,28.18 arc-90 26.81,28.02 | 26.81,28.02 | 26.81,28.02 arc90 27.09,27.87 27.13,27.88 arc90 27.29,28.15 27.29,28.15 arc-90 27.44,28.43 27.49,28.44 arc-90 27.77,28.28 | 27.77,28.28 | 27.77,28.28 arc90 28.04,28.13 28.09,28.14 arc90 28.24,28.42 | 28.24,28.42 | 28.24,28.42 arc-90 28.4,28.69 28.44,28.7 arc-90 28.72,28.55 28.72,28.55 arc90 28.99,28.39 29.04,28.41 arc90 29.19,28.68 29.19,28.68 arc-90 29.35,28.95 29.4,28.97 arc-90 29.67,28.81
  Route2 0.127: 29.67,28.81 | 29.67,28.81 arc90 29.94,28.66 29.99,28.67 arc90 30.14,28.94 | 30.14,28.94
  Route3 0.127: JP3.3 12.06,47.07 12.06,40.49 12.74,39.81 18.83,39.82 arc90 19.06,40.04 19.06,40.1 arc-90 19.28,40.32 19.29,40.32 arc-90 19.52,40.1 19.52,40.04 arc90 19.74,39.82 19.75,39.82 arc90 19.98,40.05 19.98,40.1 arc-90 20.2,40.32 20.21,40.32 arc-90 20.44,40.1 20.44,40.05 arc90 20.66,39.82 20.67,39.82 arc90 20.9,40.05 20.9,40.1 arc-90 21.12,40.32 21.13,40.32 arc-90 21.35,40.1 21.35,40.05 arc90 21.58,39.82 21.59,39.82 arc90 21.81,40.05 21.81,40.1 arc-90 22.04,40.32 22.05,40.32 arc-90 22.27,40.1 22.27,40.05 arc90 22.5,39.83 22.51,39.83 arc90 22.73,40.05 22.73,40.1 arc-90 22.96,40.33 22.97,40.33 arc-90 23.2,40.1 23.2,40.05 arc90 23.42,39.83 23.43,39.83 arc90 23.66,40.05 23.66,40.1 arc-90 23.88,40.33 23.89,40.33 arc-90 24.12,40.1 24.12,40.05 arc90 24.34,39.83 24.35,39.83 arc90 24.58,40.05 24.57,40.1 arc-90 24.8,40.33 24.81,40.33 arc-90 25.03,40.11 25.03,40.05 arc90 25.26,39.83 25.27,39.83 arc90 25.49,40.05 25.49,40.11 arc-90 25.72,40.33 25.73,40.33 arc-90 25.95,40.11 25.95,40.05 arc90 26.18,39.83 26.19,39.83 arc90 26.41,40.05 26.41,40.11 arc-90 26.64,40.33 26.65,40.33 arc-90 26.87,40.11 26.87,40.05 arc90 27.1,39.83 27.11,39.83 arc90 27.33,40.05 27.33,40.11 arc-90 27.56,40.33 27.57,40.33 arc-90 27.79,40.11 27.79,40.05 arc90 28.02,39.83 28.03,39.83 arc90 28.25,40.05 28.25,40.11 arc-90 28.48,40.33 28.49,40.33 arc-90 28.71,40.11 28.71,40.05 arc90 28.94,39.83 28.95,39.83 arc90 29.17,40.05 29.17,40.11 arc-90 29.4,40.33 29.41,40.33 arc-90 29.63,40.11 29.63,40.06 arc90 29.86,39.83 29.87,39.83 arc90 30.09,40.06 30.09,40.11 arc-90 30.31,40.33 30.33,40.33 arc-90 30.55,40.11 30.55,40.06 arc90 30.78,39.83 30.79,39.83 arc90 31.01,40.06 31.01,40.11 arc-90 31.23,40.33 31.25,40.33 arc-90 31.47,40.11 31.47,40.06 arc90 31.7,39.83 31.71,39.83 arc90 31.93,40.06 31.93,40.11 arc-90 32.16,40.33 32.17,40.33 arc-90 32.39,40.11 32.39,40.06 arc90 32.62,39.84 32.63,39.84 arc90 32.85,40.06 32.85,40.11 arc-90 33.08,40.34 33.09,40.34 arc-90 33.31,40.11 33.31,40.06 arc90 33.53,39.84 33.55,39.84 arc90 33.77,40.06 33.77,40.11 arc-90 33.99,40.34 34.01,40.34 arc-90 34.23,40.11 34.23,40.06 arc90 34.45,39.84 34.47,39.84 arc90 34.69,40.06 34.69,40.11 arc-90 34.91,40.34 34.93,40.34 arc-90 35.15,40.12 35.15,40.06 arc90 35.38,39.84 35.39,39.84 arc90 35.61,40.06 35.61,40.12 arc-90 35.83,40.34 35.85,40.34 arc-90 36.07,40.12 36.07,40.06 arc90 36.29,39.84 36.31,39.84 arc90 36.53,40.06 36.53,40.12 arc-90 36.75,40.34 36.77,40.34 arc-90 36.99,40.12 36.99,40.06 arc90 37.21,39.84 37.23,39.84 arc90 37.45,40.06 37.45,40.12 arc-90 37.67,40.34 37.69,40.34 arc-90 37.91,40.12 37.91,40.06 arc90 38.13,39.84 38.15,39.84 arc90 38.37,40.06 38.37,40.12 arc-90 38.59,40.34 38.61,40.34 arc-90 38.83,40.12 38.83,40.06 arc90 39.05,39.84 39.07,39.84 arc90 39.29,40.06 39.29,40.12 arc-90 39.51,40.34 39.53,40.34 arc-90 39.75,40.12 39.75,40.07 arc90 39.97,39.84 39.99,39.84 arc90 40.21,40.07 40.21,40.12 arc-90 40.43,40.34 40.45,40.34 arc-90 40.67,40.12 40.67,40.07 arc90 40.89,39.84 40.91,39.84 arc90 41.13,40.07 41.13,40.12 arc-90 41.35,40.34 41.37,40.34 arc-90 41.59,40.12 41.59,40.07 arc90 41.81,39.85 70.69,39.88 71.37,40.5 JP1.10
RXIN2_N
  Route2 0.127: JP1.11 73.5,41.44 70.81,41.44 69.62,41.5 30.8,36.12 arc90 30.61,35.87 30.61,35.85 arc-90 30.42,35.6 30.26,35.58 arc-90 30.01,35.77 30.01,35.78 arc90 29.76,35.97 29.6,35.95 arc90 29.41,35.7 29.41,35.69 arc-90 29.22,35.44 29.06,35.41 arc-90 28.81,35.6 28.81,35.62 arc90 28.55,35.81 9.64,33.19 8.44,31.94 7.56,31.94 7.06,32.56 6,32.94 J1.60
  Route3 0.127: JP3.10 19.31,49.49 19.31,43.51 21.26,41.56 25.3,41.56 arc-90 25.52,41.34 25.52,41.29 arc90 25.74,41.06 25.75,41.06 arc90 25.97,41.29 25.97,41.34 arc-90 26.19,41.56 26.2,41.56 arc-90 26.42,41.34 26.42,41.29 arc90 26.65,41.06 26.66,41.06 arc90 26.88,41.29 26.88,41.34 arc-90 27.1,41.56 27.11,41.56 arc-90 27.33,41.34 27.33,41.29 arc90 27.55,41.06 27.56,41.06 arc90 27.78,41.29 27.78,41.34 arc-90 28.01,41.56 28.02,41.56 arc-90 28.24,41.34 28.24,41.29 arc90 28.46,41.06 28.47,41.06 arc90 28.69,41.29 28.69,41.34 arc-90 28.91,41.56 28.92,41.56 arc-90 29.15,41.34 29.15,41.29 arc90 29.37,41.06 29.38,41.06 arc90 29.6,41.29 29.6,41.34 arc-90 29.82,41.56 29.83,41.56 arc-90 30.05,41.34 30.05,41.29 arc90 30.28,41.06 30.28,41.06 arc90 30.51,41.29 30.51,41.34 arc-90 30.73,41.56 30.74,41.56 arc-90 30.96,41.34 30.96,41.29 arc90 31.18,41.06 31.19,41.06 arc90 31.41,41.29 31.41,41.34 arc-90 31.64,41.56 31.65,41.56 arc-90 31.87,41.34 31.87,41.29 arc90 32.09,41.06 32.1,41.06 arc90 32.32,41.29 32.32,41.34 arc-90 32.55,41.56 32.55,41.56 arc-90 32.78,41.34 32.78,41.29 arc90 33,41.06 33.01,41.06 arc90 33.23,41.29 33.23,41.34 arc-90 33.45,41.56 33.46,41.56 arc-90 33.68,41.34 33.68,41.29 arc90 33.91,41.06 33.91,41.06 arc90 34.14,41.29 34.14,41.34 arc-90 34.36,41.56 34.37,41.56 arc-90 34.59,41.34 34.59,41.29 arc90 34.81,41.06 34.82,41.06 arc90 35.04,41.29 35.04,41.34 arc-90 35.27,41.56 35.28,41.56 arc-90 35.5,41.34 35.5,41.29 arc90 35.72,41.06 35.73,41.06 arc90 35.95,41.29 35.95,41.34 arc-90 36.17,41.56 36.18,41.56 arc-90 36.41,41.34 36.41,41.29 arc90 36.63,41.06 36.64,41.06 arc90 36.86,41.29 36.86,41.34 arc-90 37.08,41.56 37.09,41.56 arc-90 37.31,41.34 37.31,41.29 arc90 37.53,41.06 37.54,41.06 arc90 37.77,41.29 37.77,41.34 arc-90 37.99,41.56 38,41.56 arc-90 38.22,41.34 38.22,41.29 arc90 38.44,41.06 38.45,41.06 arc90 38.67,41.29 38.67,41.34 arc-90 38.9,41.56 38.91,41.56 arc-90 39.13,41.34 39.13,41.29 arc90 39.35,41.06 39.36,41.06 arc90 39.58,41.29 39.58,41.34 arc-90 39.8,41.56 39.81,41.56 arc-90 40.03,41.34 40.03,41.29 arc90 40.26,41.06 40.27,41.06 arc90 40.49,41.29 40.49,41.34 arc-90 40.71,41.56 40.72,41.56 arc-90 40.94,41.34 40.94,41.29 arc90 41.16,41.06 41.17,41.06 arc90 41.4,41.29 41.4,41.34 arc-90 41.62,41.56 41.63,41.56 arc-90 41.85,41.34 41.85,41.29 arc90 42.07,41.06 42.08,41.06 arc90 42.3,41.29 42.3,41.34 arc-90 42.53,41.56 42.53,41.56 arc-90 42.76,41.34 42.76,41.29 arc90 42.98,41.06 42.99,41.06 arc90 43.21,41.29 43.21,41.34 arc-90 43.43,41.56 43.44,41.56 arc-90 43.66,41.34 43.66,41.29 arc90 43.89,41.06 43.9,41.06 arc90 44.12,41.29 44.12,41.34 arc-90 44.34,41.56 44.35,41.56 arc-90 44.57,41.34 44.57,41.29 arc90 44.79,41.06 44.8,41.06 arc90 45.03,41.29 45.03,41.34 arc-90 45.25,41.56 45.26,41.56 arc-90 45.48,41.34 45.48,41.29 arc90 45.7,41.06 45.71,41.06 arc90 45.93,41.29 45.93,41.34 arc-90 46.16,41.56 46.16,41.56 arc-90 46.39,41.34 46.39,41.29 arc90 46.61,41.06 46.62,41.06 arc90 46.84,41.29 46.84,41.34 arc-90 47.06,41.56 70.38,41.56 74.44,41.56 74.5,41.62 JP1.11
RXIN2_P
  Route2 0.127: JP1.12 69.62,41.81 41.4,37.9 arc-90 41.15,38.09 41.15,38.09 arc90 40.9,38.28 40.85,38.28 arc90 40.66,38.03 40.66,38.02 arc-90 40.47,37.77 40.41,37.76 arc-90 40.16,37.95 40.16,37.96 arc90 39.91,38.15 39.86,38.14 arc90 39.67,37.89 39.67,37.89 arc-90 39.48,37.63 39.43,37.63 arc-90 39.17,37.82 39.17,37.82 arc90 38.92,38.01 38.87,38 arc90 38.68,37.75 38.68,37.75 arc-90 38.49,37.5 38.44,37.49 arc-90 38.19,37.68 38.19,37.68 arc90 37.94,37.87 37.88,37.86 arc90 37.69,37.61 37.69,37.61 arc-90 37.5,37.36 37.45,37.35 arc-90 37.2,37.54 37.2,37.55 arc90 36.95,37.74 36.89,37.73 arc90 36.7,37.48 36.7,37.47 arc-90 36.51,37.22 36.46,37.22 arc-90 36.21,37.41 36.21,37.41 arc90 35.96,37.6 35.9,37.59 arc90 35.71,37.34 35.71,37.34 arc-90 35.52,37.09 35.47,37.08 arc-90 35.22,37.27 35.22,37.27 arc90 34.97,37.46 34.91,37.45 arc90 34.72,37.2 34.72,37.2 arc-90 34.53,36.95 34.48,36.94 arc-90 34.23,37.13 34.23,37.14 arc90 33.98,37.32 33.92,37.32 arc90 33.73,37.07 33.73,37.06 arc-90 33.55,36.81 33.49,36.8 arc-90 33.24,36.99 33.24,37 arc90 32.99,37.19 32.94,37.18 arc90 32.75,36.93 32.75,36.92 arc-90 32.56,36.67 32.5,36.67 arc-90 32.25,36.86 32.25,36.86 arc90 32,37.05 31.95,37.04 arc90 31.76,36.79 31.76,36.79 arc-90 31.57,36.54 31.51,36.53 arc-90 31.26,36.72 31.26,36.72 arc90 31.01,36.91 30.96,36.91 arc90 30.77,36.66 30.77,36.65 arc-90 30.58,36.4 30.52,36.39 arc-90 30.27,36.58 30.27,36.59 arc90 30.02,36.78 29.97,36.77 arc90 29.78,36.52 29.78,36.51 arc-90 29.59,36.26 29.53,36.26 arc-90 29.28,36.45 29.28,36.45 arc90 29.03,36.64 28.98,36.63 arc90 28.79,36.38 28.79,36.38 arc-90 28.6,36.13 9.67,33.5 J1.26
  Route3 0.127: JP3.9 19.56,46.95 19.56,43.61 21.37,41.81 25.23,41.82 arc90 25.46,42.04 25.46,42.33 arc-90 25.68,42.56 25.7,42.56 arc-90 25.92,42.34 25.92,42.04 arc90 26.14,41.82 26.16,41.82 arc90 26.38,42.04 26.38,42.34 arc-90 26.6,42.56 26.62,42.56 arc-90 26.84,42.34 26.84,42.04 arc90 27.06,41.82 27.08,41.82 arc90 27.3,42.04 27.3,42.34 arc-90 27.52,42.56 27.54,42.56 arc-90 27.77,42.34 27.77,42.05 arc90 27.99,41.82 28.01,41.82 arc90 28.23,42.05 28.23,42.34 arc-90 28.45,42.56 28.47,42.56 arc-90 28.69,42.34 28.69,42.05 arc90 28.91,41.82 28.93,41.82 arc90 29.15,42.05 29.15,42.34 arc-90 29.37,42.56 29.39,42.56 arc-90 29.61,42.34 29.61,42.05 arc90 29.83,41.83 29.85,41.83 arc90 30.07,42.05 30.07,42.34 arc-90 30.3,42.56 30.31,42.56 arc-90 30.53,42.34 30.53,42.05 arc90 30.76,41.83 30.77,41.83 arc90 31,42.05 31,42.34 arc-90 31.22,42.56 31.23,42.56 arc-90 31.46,42.34 31.46,42.05 arc90 31.68,41.83 31.7,41.83 arc90 31.92,42.05 31.92,42.34 arc-90 32.14,42.57 32.16,42.57 arc-90 32.38,42.34 32.38,42.05 arc90 32.6,41.83 32.62,41.83 arc90 32.84,42.05 32.84,42.34 arc-90 33.06,42.57 33.08,42.57 arc-90 33.3,42.34 33.3,42.05 arc90 33.53,41.83 33.55,41.83 arc90 33.77,42.05 33.77,42.35 arc-90 33.99,42.57 34.01,42.57 arc-90 34.23,42.35 34.23,42.05 arc90 34.45,41.83 34.47,41.83 arc90 34.69,42.05 34.69,42.35 arc-90 34.91,42.57 34.93,42.57 arc-90 35.15,42.35 35.15,42.05 arc90 35.37,41.83 35.39,41.83 arc90 35.61,42.06 35.61,42.35 arc-90 35.84,42.57 35.85,42.57 arc-90 36.07,42.35 36.08,42.06 arc90 36.3,41.83 36.31,41.83 arc90 36.54,42.06 36.54,42.35 arc-90 36.76,42.57 36.77,42.57 arc-90 37,42.35 37,42.06 arc90 37.22,41.83 37.24,41.83 arc90 37.46,42.06 37.46,42.35 arc-90 37.68,42.57 37.7,42.57 arc-90 37.92,42.35 37.92,42.06 arc90 38.14,41.84 38.16,41.84 arc90 38.38,42.06 38.38,42.35 arc-90 38.6,42.57 38.62,42.57 arc-90 38.84,42.35 38.84,42.06 arc90 39.07,41.84 39.08,41.84 arc90 39.31,42.06 39.31,42.35 arc-90 39.53,42.58 39.55,42.58 arc-90 39.77,42.35 39.77,42.06 arc90 39.99,41.84 40.01,41.84 arc90 40.23,42.06 40.23,42.35 arc-90 40.45,42.58 40.47,42.58 arc-90 40.69,42.36 40.69,42.06 arc90 40.91,41.84 40.93,41.84 arc90 41.15,42.06 41.15,42.36 arc-90 41.37,42.58 41.39,42.58 arc-90 41.61,42.36 41.61,42.06 arc90 41.84,41.84 41.85,41.84 arc90 42.08,42.06 42.08,42.36 arc-90 42.3,42.58 42.31,42.58 arc-90 42.54,42.36 42.54,42.06 arc90 42.76,41.84 42.78,41.84 arc90 43,42.06 43,42.36 arc-90 43.22,42.58 43.24,42.58 arc-90 43.46,42.36 43.46,42.06 arc90 43.68,41.84 43.7,41.84 arc90 43.92,42.07 43.92,42.36 arc-90 44.14,42.58 44.16,42.58 arc-90 44.38,42.36 44.38,42.07 arc90 44.61,41.84 44.62,41.84 arc90 44.84,42.07 44.84,42.36 arc-90 45.07,42.58 45.08,42.58 arc-90 45.31,42.36 45.31,42.07 arc90 45.53,41.84 45.55,41.84 arc90 45.77,42.07 45.77,42.36 arc-90 45.99,42.58 46.01,42.58 arc-90 46.23,42.36 46.23,42.07 arc90 46.45,41.85 46.47,41.85 arc90 46.69,42.07 46.69,42.36 arc-90 46.91,42.58 46.93,42.58 arc-90 47.15,42.36 47.15,42.07 arc90 47.38,41.85 70.38,41.88 71.06,42.5 JP1.12
VCC
  Top 0.254: JP1.2 72.54,32.62 74.37,32.62 JP1.1 | 57.45,49.54 50.82,49.54 49.68,48.39 48.77,48.39 JP3.31 | 57.45,49.54 58.59,50.68 JP3.40 | 57.45,49.54 57.45,47.94 72.31,33.08 72.31,32.62 JP1.2 | JP2.34 51.05,4.73 49.91,3.59 43.28,3.59 42.13,2.45 41.22,2.45 JP2.25 40.99,2.45 40.08,3.36 33.22,3.36 31.85,4.73 30.93,4.73 JP2.18 30.7,4.96 7.84,27.82 J1.19 | J1.50 4.42,25.08 6.25,25.08 6.47,25.31 J1.16 6.47,25.53 6.47,26.22 5.56,27.13 5.56,27.36 J1.53 | JP1.4 JP1.2
  Bottom 0.254: JP3.31 48.54,48.39 47.39,49.54 40.53,49.54 39.39,50.68 38.71,50.68 JP3.24 38.48,50.68 37.56,50.68 36.42,49.54 29.56,49.54 28.42,48.39 JP3.15 28.19,48.39 27.28,48.39 26.13,49.54 19.5,49.54 18.36,50.68 JP3.8 18.13,50.68 16.99,49.54 16.99,40.85 | JP2.41 61.34,2.45 60.19,2.45 59.05,3.59 52.42,3.59 51.28,4.73 JP2.34 | 16.99,40.85 16.99,37.42 8.07,28.51 8.07,28.05 J1.19 | 16.99,40.85 6.47,40.85 6.25,40.62 4.19,40.62 3.5,39.94 3.5,25.99 4.19,25.31 J1.50
VCC_12
  Top 0.254: JP4.6 72.54,28.28 72.54,26.68 JP4.5 72.31,26.45 72.31,25.99 65.91,19.59 65.91,12.51 | 65.91,12.51 65.91,10.91 U$1.TIP 65.91,12.51 | 65.91,12.51 60.19,12.51 C1.+